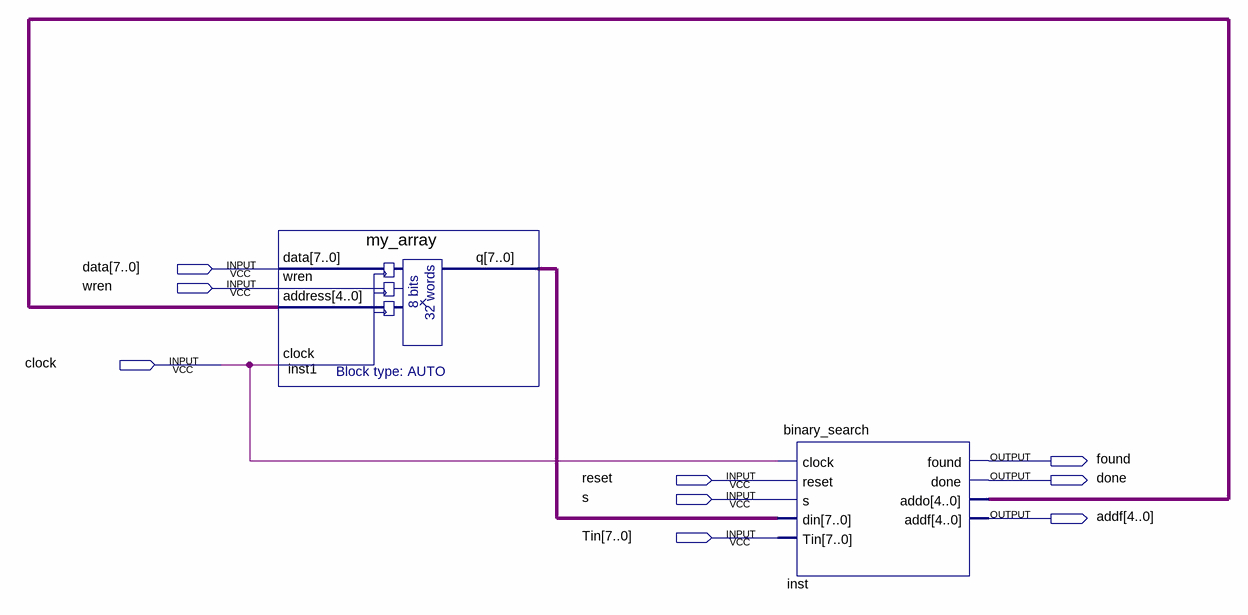
[diagram p0: schematic sheet]
// Quartus schematic Lab11Part2.bdf as structural Verilog: 2 symbols, 9 pins
module Lab11Part2 (
  input  [7:0] data,
  input  wren,
  input  clock,
  input  reset,
  input  s,
  input  [7:0] Tin,
  output found,
  output done,
  output [4:0] addf
);

  wire [4:0] inst_addo;
  wire [7:0] inst1_q;

  my_array inst1 (.data(data), .wren(wren), .address(inst_addo), .clock(clock), .q(inst1_q));
  binary_search inst (
    .clock(clock), .reset(reset), .s(s), .din(inst1_q), .Tin(Tin), .found(found), .done(done),
    .addo(inst_addo), .addf(addf));
endmodule
